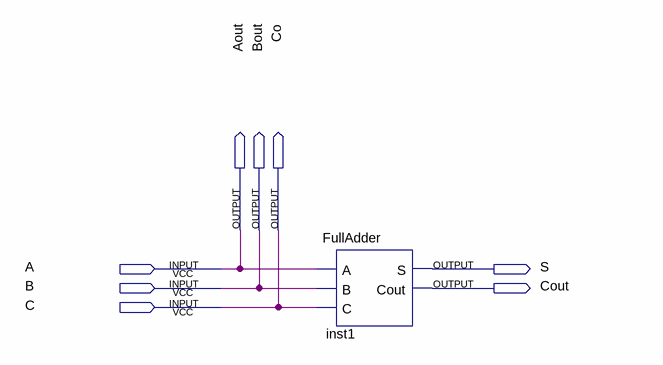
[diagram p0: schematic sheet]
// Quartus schematic Lab5FA.bdf as structural Verilog: 1 symbols, 8 pins
module Lab5FA (
  input  A,
  input  B,
  input  C,
  output Aout,
  output Bout,
  output Co,
  output S,
  output Cout
);

  FullAdder inst1 (.A(A), .B(B), .C(C), .S(S), .Cout(Cout));

  assign Aout = A;
  assign Bout = B;
  assign Co = C;
endmodule
